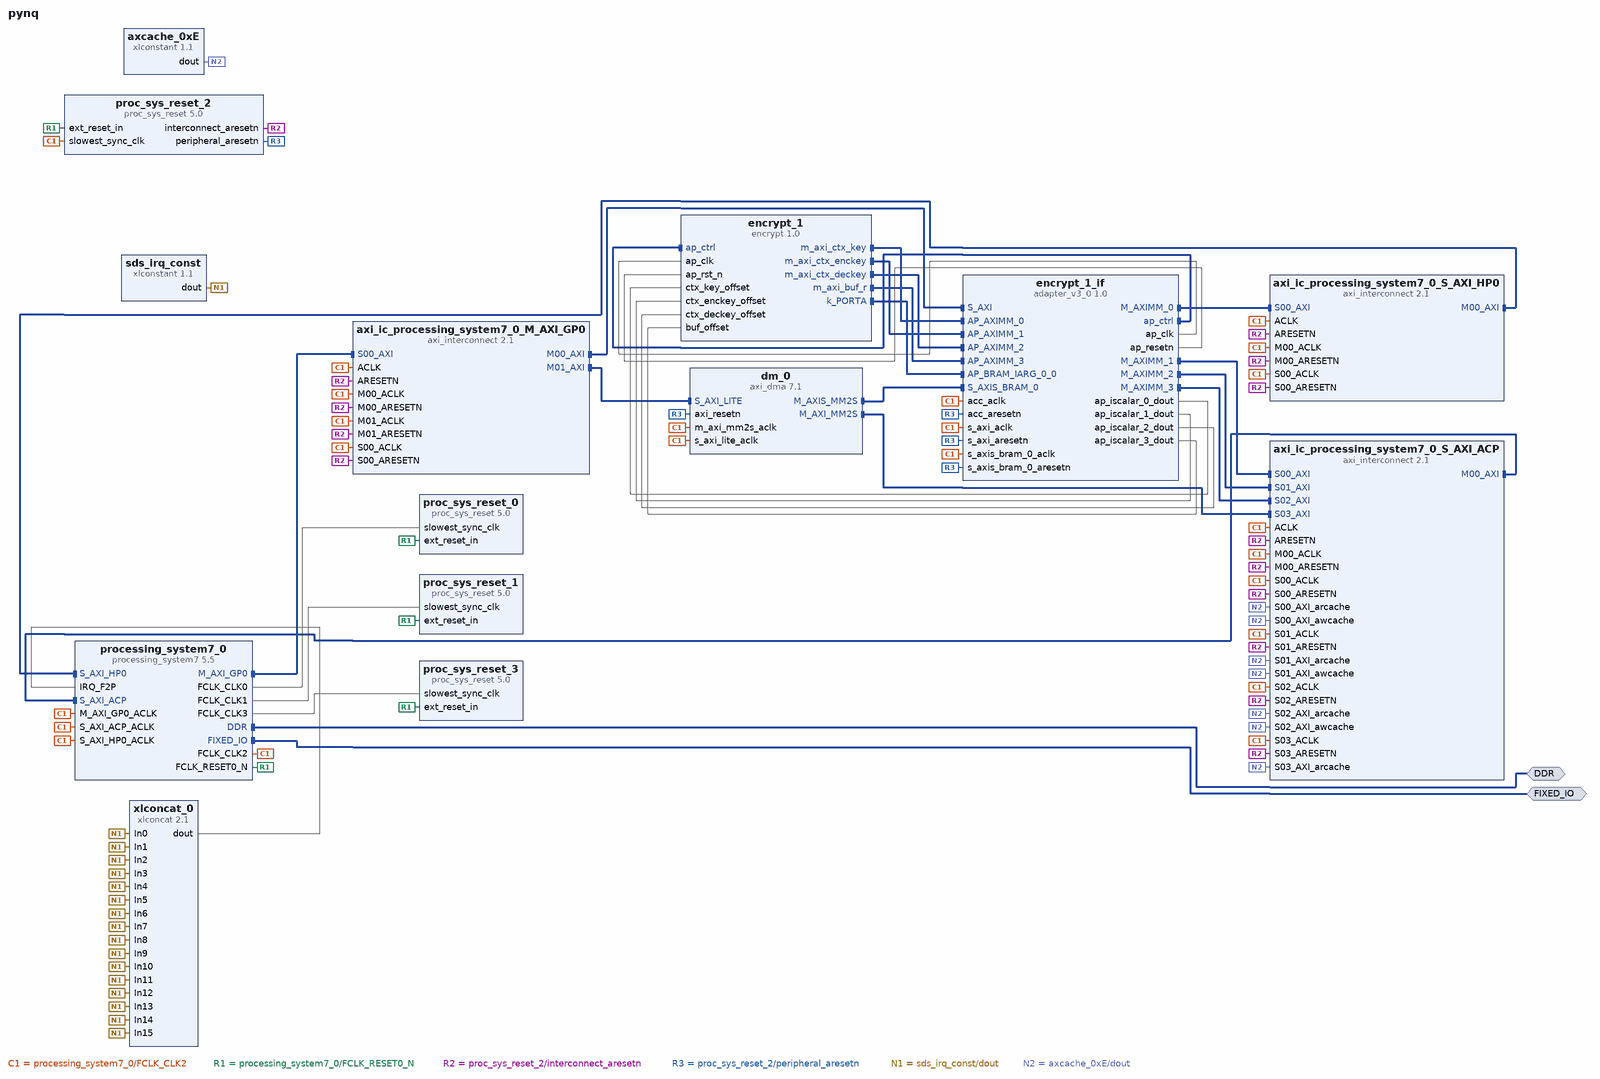
[diagram p0: block diagram of the top level]
# Vivado block design pynq, xc7z020clg400-1, Vivado 2017.1_sdx
create_bd_design pynq

create_bd_intf_port -mode Master -vlnv xilinx.com:interface:ddrx_rtl:1.0 DDR
create_bd_intf_port -mode Master -vlnv xilinx.com:display_processing_system7:fixedio_rtl:1.0 FIXED_IO

create_bd_cell -type ip -vlnv xilinx.com:ip:proc_sys_reset:5.0 proc_sys_reset_0
create_bd_cell -type ip -vlnv xilinx.com:ip:proc_sys_reset:5.0 proc_sys_reset_1
create_bd_cell -type ip -vlnv xilinx.com:ip:proc_sys_reset:5.0 proc_sys_reset_2
create_bd_cell -type ip -vlnv xilinx.com:ip:proc_sys_reset:5.0 proc_sys_reset_3
create_bd_cell -type ip -vlnv xilinx.com:ip:processing_system7:5.5 processing_system7_0
set_property -dict [list \
  CONFIG.PCW_FCLK_CLK1_BUF TRUE \
  CONFIG.PCW_FCLK_CLK2_BUF TRUE \
  CONFIG.PCW_FCLK_CLK3_BUF TRUE \
  CONFIG.PCW_UIPARAM_DDR_FREQ_MHZ 525 \
  CONFIG.PCW_CRYSTAL_PERIPHERAL_FREQMHZ 50 \
  CONFIG.PCW_APU_PERIPHERAL_FREQMHZ 650 \
  CONFIG.PCW_SDIO_PERIPHERAL_FREQMHZ 50 \
  CONFIG.PCW_UART_PERIPHERAL_FREQMHZ 100 \
  CONFIG.PCW_FPGA0_PERIPHERAL_FREQMHZ 166 \
  CONFIG.PCW_FPGA1_PERIPHERAL_FREQMHZ 142 \
  CONFIG.PCW_FPGA2_PERIPHERAL_FREQMHZ 100 \
  CONFIG.PCW_FPGA3_PERIPHERAL_FREQMHZ 200 \
  CONFIG.PCW_USE_S_AXI_ACP 1 \
  CONFIG.PCW_USE_S_AXI_HP0 1 \
  CONFIG.PCW_USE_FABRIC_INTERRUPT 1 \
  CONFIG.PCW_USE_DEFAULT_ACP_USER_VAL 1 \
  CONFIG.PCW_EN_CLK1_PORT 1 \
  CONFIG.PCW_EN_CLK2_PORT 1 \
  CONFIG.PCW_EN_CLK3_PORT 1 \
  CONFIG.PCW_IRQ_F2P_INTR 1 \
  CONFIG.PCW_PERIPHERAL_BOARD_PRESET None \
  CONFIG.PCW_PRESET_BANK1_VOLTAGE {LVCMOS 1.8V} \
  CONFIG.PCW_UIPARAM_DDR_BUS_WIDTH {16 Bit} \
  CONFIG.PCW_UIPARAM_DDR_PARTNO {MT41J256M16 RE-125} \
  CONFIG.PCW_QSPI_PERIPHERAL_ENABLE 1 \
  CONFIG.PCW_QSPI_QSPI_IO {MIO 1 .. 6} \
  CONFIG.PCW_QSPI_GRP_SINGLE_SS_ENABLE 1 \
  CONFIG.PCW_QSPI_GRP_SINGLE_SS_IO {MIO 1 .. 6} \
  CONFIG.PCW_QSPI_GRP_FBCLK_ENABLE 1 \
  CONFIG.PCW_QSPI_GRP_FBCLK_IO {MIO 8} \
  CONFIG.PCW_ENET0_PERIPHERAL_ENABLE 1 \
  CONFIG.PCW_ENET0_ENET0_IO {MIO 16 .. 27} \
  CONFIG.PCW_ENET0_GRP_MDIO_ENABLE 1 \
  CONFIG.PCW_ENET0_GRP_MDIO_IO {MIO 52 .. 53} \
  CONFIG.PCW_ENET_RESET_ENABLE 1 \
  CONFIG.PCW_ENET_RESET_SELECT {Share reset pin} \
  CONFIG.PCW_ENET0_RESET_ENABLE 1 \
  CONFIG.PCW_ENET0_RESET_IO {MIO 9} \
  CONFIG.PCW_SD0_PERIPHERAL_ENABLE 1 \
  CONFIG.PCW_SD0_SD0_IO {MIO 40 .. 45} \
  CONFIG.PCW_SD0_GRP_CD_ENABLE 1 \
  CONFIG.PCW_SD0_GRP_CD_IO {MIO 47} \
  CONFIG.PCW_SD0_GRP_WP_ENABLE 0 \
  CONFIG.PCW_UART0_PERIPHERAL_ENABLE 1 \
  CONFIG.PCW_UART0_UART0_IO {MIO 14 .. 15} \
  CONFIG.PCW_UART1_PERIPHERAL_ENABLE 0 \
  CONFIG.PCW_USB0_PERIPHERAL_ENABLE 1 \
  CONFIG.PCW_USB0_USB0_IO {MIO 28 .. 39} \
  CONFIG.PCW_USB_RESET_ENABLE 1 \
  CONFIG.PCW_USB_RESET_SELECT {Share reset pin} \
  CONFIG.PCW_USB0_RESET_ENABLE 1 \
  CONFIG.PCW_USB0_RESET_IO {MIO 46} \
  CONFIG.PCW_I2C_RESET_ENABLE 1 \
  CONFIG.PCW_GPIO_MIO_GPIO_ENABLE 1 \
  CONFIG.PCW_GPIO_MIO_GPIO_IO MIO \
  CONFIG.PCW_FPGA_FCLK1_ENABLE 1 \
  CONFIG.PCW_FPGA_FCLK2_ENABLE 1 \
  CONFIG.PCW_FPGA_FCLK3_ENABLE 1 \
] [get_bd_cells processing_system7_0]
# 502 more settings of processing_system7_0 are not shown: defaults, MIO pin electricals, DDR timing, and values the tool derives
create_bd_cell -type ip -vlnv xilinx.com:ip:xlconcat:2.1 xlconcat_0
set_property -dict {CONFIG.NUM_PORTS 16} [get_bd_cells xlconcat_0]
create_bd_cell -type ip -vlnv xilinx.com:ip:axi_dma:7.1 dm_0
set_property -dict [list \
  CONFIG.c_include_sg 0 \
  CONFIG.c_sg_length_width 23 \
  CONFIG.c_dlytmr_resolution 1250 \
  CONFIG.c_include_mm2s 1 \
  CONFIG.c_m_axi_mm2s_data_width 64 \
  CONFIG.c_m_axis_mm2s_tdata_width 64 \
  CONFIG.c_include_mm2s_dre 1 \
  CONFIG.c_include_mm2s_sf 1 \
  CONFIG.c_mm2s_burst_size 64 \
  CONFIG.c_include_s2mm 0 \
] [get_bd_cells dm_0]
create_bd_cell -type ip -vlnv xilinx.com:hls:encrypt:1.0 encrypt_1
create_bd_cell -type ip -vlnv xilinx.com:ip:adapter_v3_0:1.0 encrypt_1_if
set_property -dict [list \
  CONFIG.C_N_INPUT_SCALARS 4 \
  CONFIG.C_INPUT_SCALAR_0_WIDTH 32 \
  CONFIG.C_INPUT_SCALAR_1_WIDTH 32 \
  CONFIG.C_INPUT_SCALAR_2_WIDTH 32 \
  CONFIG.C_INPUT_SCALAR_3_WIDTH 32 \
  CONFIG.C_NUM_INPUT_BRAMs 1 \
  CONFIG.S_AXIS_BRAM_0_WIDTH 8 \
  CONFIG.S_AXIS_BRAM_0_DEPTH 32 \
  CONFIG.S_AXIS_BRAM_0_DMWIDTH 64 \
  CONFIG.S_AXIS_BRAM_0_MB_DEPTH 1 \
  CONFIG.C_NUM_AXIMMs 4 \
  CONFIG.M_AXIMM_ADDR_WIDTH 32 \
] [get_bd_cells encrypt_1_if]
create_bd_cell -type ip -vlnv xilinx.com:ip:axi_interconnect:2.1 axi_ic_processing_system7_0_M_AXI_GP0
set_property -dict [list \
  CONFIG.NUM_SI 1 \
  CONFIG.NUM_MI 2 \
  CONFIG.STRATEGY 2 \
  CONFIG.M00_HAS_REGSLICE 1 \
  CONFIG.M01_HAS_REGSLICE 1 \
  CONFIG.S00_HAS_REGSLICE 1 \
] [get_bd_cells axi_ic_processing_system7_0_M_AXI_GP0]
create_bd_cell -type ip -vlnv xilinx.com:ip:axi_interconnect:2.1 axi_ic_processing_system7_0_S_AXI_HP0
set_property -dict [list \
  CONFIG.NUM_SI 1 \
  CONFIG.NUM_MI 1 \
  CONFIG.STRATEGY 0 \
  CONFIG.M00_HAS_REGSLICE 1 \
  CONFIG.M00_HAS_DATA_FIFO 2 \
  CONFIG.S00_HAS_REGSLICE 1 \
  CONFIG.S00_HAS_DATA_FIFO 2 \
] [get_bd_cells axi_ic_processing_system7_0_S_AXI_HP0]
create_bd_cell -type ip -vlnv xilinx.com:ip:axi_interconnect:2.1 axi_ic_processing_system7_0_S_AXI_ACP
set_property -dict [list \
  CONFIG.NUM_SI 4 \
  CONFIG.NUM_MI 1 \
  CONFIG.STRATEGY 2 \
  CONFIG.M00_HAS_REGSLICE 1 \
  CONFIG.M00_HAS_DATA_FIFO 2 \
  CONFIG.S00_HAS_REGSLICE 1 \
  CONFIG.S01_HAS_REGSLICE 1 \
  CONFIG.S02_HAS_REGSLICE 1 \
  CONFIG.S03_HAS_REGSLICE 1 \
  CONFIG.S00_HAS_DATA_FIFO 2 \
  CONFIG.S01_HAS_DATA_FIFO 2 \
  CONFIG.S02_HAS_DATA_FIFO 2 \
  CONFIG.S03_HAS_DATA_FIFO 2 \
] [get_bd_cells axi_ic_processing_system7_0_S_AXI_ACP]
create_bd_cell -type ip -vlnv xilinx.com:ip:xlconstant:1.1 sds_irq_const
set_property -dict {CONFIG.CONST_WIDTH 1 CONFIG.CONST_VAL 0} [get_bd_cells sds_irq_const]
create_bd_cell -type ip -vlnv xilinx.com:ip:xlconstant:1.1 axcache_0xE
set_property -dict {CONFIG.CONST_WIDTH 4 CONFIG.CONST_VAL 14} [get_bd_cells axcache_0xE]

# ---- connections ----

connect_bd_intf_net [get_bd_intf_pins encrypt_1_if/ap_ctrl] [get_bd_intf_pins encrypt_1/ap_ctrl]
connect_bd_intf_net [get_bd_intf_pins encrypt_1/m_axi_ctx_key] [get_bd_intf_pins encrypt_1_if/AP_AXIMM_0]
connect_bd_intf_net [get_bd_intf_pins encrypt_1/m_axi_ctx_enckey] [get_bd_intf_pins encrypt_1_if/AP_AXIMM_1]
connect_bd_intf_net [get_bd_intf_pins encrypt_1/m_axi_ctx_deckey] [get_bd_intf_pins encrypt_1_if/AP_AXIMM_2]
connect_bd_intf_net [get_bd_intf_pins encrypt_1/m_axi_buf_r] [get_bd_intf_pins encrypt_1_if/AP_AXIMM_3]
connect_bd_intf_net [get_bd_intf_pins encrypt_1/k_PORTA] [get_bd_intf_pins encrypt_1_if/AP_BRAM_IARG_0_0]
connect_bd_intf_net [get_bd_intf_pins processing_system7_0/M_AXI_GP0] [get_bd_intf_pins axi_ic_processing_system7_0_M_AXI_GP0/S00_AXI]
connect_bd_intf_net [get_bd_intf_pins axi_ic_processing_system7_0_S_AXI_HP0/M00_AXI] [get_bd_intf_pins processing_system7_0/S_AXI_HP0]
connect_bd_intf_net [get_bd_intf_pins axi_ic_processing_system7_0_S_AXI_ACP/M00_AXI] [get_bd_intf_pins processing_system7_0/S_AXI_ACP]
connect_bd_intf_net [get_bd_intf_pins encrypt_1_if/M_AXIMM_0] [get_bd_intf_pins axi_ic_processing_system7_0_S_AXI_HP0/S00_AXI]
connect_bd_intf_net [get_bd_intf_pins encrypt_1_if/M_AXIMM_1] [get_bd_intf_pins axi_ic_processing_system7_0_S_AXI_ACP/S00_AXI]
connect_bd_intf_net [get_bd_intf_pins encrypt_1_if/M_AXIMM_2] [get_bd_intf_pins axi_ic_processing_system7_0_S_AXI_ACP/S01_AXI]
connect_bd_intf_net [get_bd_intf_pins encrypt_1_if/M_AXIMM_3] [get_bd_intf_pins axi_ic_processing_system7_0_S_AXI_ACP/S02_AXI]
connect_bd_intf_net [get_bd_intf_pins axi_ic_processing_system7_0_M_AXI_GP0/M00_AXI] [get_bd_intf_pins encrypt_1_if/S_AXI]
connect_bd_intf_net [get_bd_intf_pins axi_ic_processing_system7_0_M_AXI_GP0/M01_AXI] [get_bd_intf_pins dm_0/S_AXI_LITE]
connect_bd_intf_net [get_bd_intf_pins dm_0/M_AXI_MM2S] [get_bd_intf_pins axi_ic_processing_system7_0_S_AXI_ACP/S03_AXI]
connect_bd_intf_net [get_bd_intf_pins dm_0/M_AXIS_MM2S] [get_bd_intf_pins encrypt_1_if/S_AXIS_BRAM_0]
connect_bd_intf_net [get_bd_intf_ports DDR] [get_bd_intf_pins processing_system7_0/DDR]
connect_bd_intf_net [get_bd_intf_ports FIXED_IO] [get_bd_intf_pins processing_system7_0/FIXED_IO]
connect_bd_net [get_bd_pins processing_system7_0/FCLK_CLK0] [get_bd_pins proc_sys_reset_0/slowest_sync_clk]
connect_bd_net [get_bd_pins processing_system7_0/FCLK_CLK1] [get_bd_pins proc_sys_reset_1/slowest_sync_clk]
connect_bd_net [get_bd_pins processing_system7_0/FCLK_CLK2] \
  [get_bd_pins proc_sys_reset_2/slowest_sync_clk] [get_bd_pins dm_0/s_axi_lite_aclk] [get_bd_pins dm_0/m_axi_mm2s_aclk] \
  [get_bd_pins processing_system7_0/M_AXI_GP0_ACLK] [get_bd_pins encrypt_1_if/s_axi_aclk] [get_bd_pins encrypt_1_if/acc_aclk] \
  [get_bd_pins encrypt_1_if/s_axis_bram_0_aclk] [get_bd_pins axi_ic_processing_system7_0_M_AXI_GP0/S00_ACLK] \
  [get_bd_pins axi_ic_processing_system7_0_M_AXI_GP0/M00_ACLK] [get_bd_pins axi_ic_processing_system7_0_M_AXI_GP0/M01_ACLK] \
  [get_bd_pins axi_ic_processing_system7_0_M_AXI_GP0/ACLK] [get_bd_pins axi_ic_processing_system7_0_S_AXI_HP0/M00_ACLK] \
  [get_bd_pins axi_ic_processing_system7_0_S_AXI_HP0/S00_ACLK] [get_bd_pins axi_ic_processing_system7_0_S_AXI_ACP/M00_ACLK] \
  [get_bd_pins axi_ic_processing_system7_0_S_AXI_ACP/S00_ACLK] [get_bd_pins axi_ic_processing_system7_0_S_AXI_ACP/S01_ACLK] \
  [get_bd_pins axi_ic_processing_system7_0_S_AXI_ACP/S02_ACLK] [get_bd_pins axi_ic_processing_system7_0_S_AXI_ACP/S03_ACLK] \
  [get_bd_pins axi_ic_processing_system7_0_S_AXI_HP0/ACLK] [get_bd_pins processing_system7_0/S_AXI_HP0_ACLK] \
  [get_bd_pins axi_ic_processing_system7_0_S_AXI_ACP/ACLK] [get_bd_pins processing_system7_0/S_AXI_ACP_ACLK]
connect_bd_net [get_bd_pins processing_system7_0/FCLK_CLK3] [get_bd_pins proc_sys_reset_3/slowest_sync_clk]
connect_bd_net [get_bd_pins processing_system7_0/FCLK_RESET0_N] \
  [get_bd_pins proc_sys_reset_0/ext_reset_in] [get_bd_pins proc_sys_reset_1/ext_reset_in] \
  [get_bd_pins proc_sys_reset_2/ext_reset_in] [get_bd_pins proc_sys_reset_3/ext_reset_in]
connect_bd_net [get_bd_pins xlconcat_0/dout] [get_bd_pins processing_system7_0/IRQ_F2P]
connect_bd_net [get_bd_pins encrypt_1_if/ap_clk] [get_bd_pins encrypt_1/ap_clk]
connect_bd_net [get_bd_pins encrypt_1_if/ap_resetn] [get_bd_pins encrypt_1/ap_rst_n]
connect_bd_net [get_bd_pins encrypt_1_if/ap_iscalar_0_dout] [get_bd_pins encrypt_1/ctx_key_offset]
connect_bd_net [get_bd_pins encrypt_1_if/ap_iscalar_1_dout] [get_bd_pins encrypt_1/ctx_enckey_offset]
connect_bd_net [get_bd_pins encrypt_1_if/ap_iscalar_2_dout] [get_bd_pins encrypt_1/ctx_deckey_offset]
connect_bd_net [get_bd_pins encrypt_1_if/ap_iscalar_3_dout] [get_bd_pins encrypt_1/buf_offset]
connect_bd_net [get_bd_pins proc_sys_reset_2/interconnect_aresetn] \
  [get_bd_pins axi_ic_processing_system7_0_M_AXI_GP0/S00_ARESETN] \
  [get_bd_pins axi_ic_processing_system7_0_M_AXI_GP0/M00_ARESETN] \
  [get_bd_pins axi_ic_processing_system7_0_M_AXI_GP0/M01_ARESETN] [get_bd_pins axi_ic_processing_system7_0_M_AXI_GP0/ARESETN] \
  [get_bd_pins axi_ic_processing_system7_0_S_AXI_HP0/M00_ARESETN] \
  [get_bd_pins axi_ic_processing_system7_0_S_AXI_HP0/S00_ARESETN] \
  [get_bd_pins axi_ic_processing_system7_0_S_AXI_ACP/M00_ARESETN] \
  [get_bd_pins axi_ic_processing_system7_0_S_AXI_ACP/S00_ARESETN] \
  [get_bd_pins axi_ic_processing_system7_0_S_AXI_ACP/S01_ARESETN] \
  [get_bd_pins axi_ic_processing_system7_0_S_AXI_ACP/S02_ARESETN] \
  [get_bd_pins axi_ic_processing_system7_0_S_AXI_ACP/S03_ARESETN] [get_bd_pins axi_ic_processing_system7_0_S_AXI_HP0/ARESETN] \
  [get_bd_pins axi_ic_processing_system7_0_S_AXI_ACP/ARESETN]
connect_bd_net [get_bd_pins proc_sys_reset_2/peripheral_aresetn] \
  [get_bd_pins dm_0/axi_resetn] [get_bd_pins encrypt_1_if/s_axi_aresetn] [get_bd_pins encrypt_1_if/acc_aresetn] \
  [get_bd_pins encrypt_1_if/s_axis_bram_0_aresetn]
connect_bd_net [get_bd_pins sds_irq_const/dout] \
  [get_bd_pins xlconcat_0/In0] [get_bd_pins xlconcat_0/In1] [get_bd_pins xlconcat_0/In2] [get_bd_pins xlconcat_0/In3] \
  [get_bd_pins xlconcat_0/In4] [get_bd_pins xlconcat_0/In5] [get_bd_pins xlconcat_0/In6] [get_bd_pins xlconcat_0/In7] \
  [get_bd_pins xlconcat_0/In8] [get_bd_pins xlconcat_0/In9] [get_bd_pins xlconcat_0/In10] [get_bd_pins xlconcat_0/In11] \
  [get_bd_pins xlconcat_0/In12] [get_bd_pins xlconcat_0/In13] [get_bd_pins xlconcat_0/In14] [get_bd_pins xlconcat_0/In15]
connect_bd_net [get_bd_pins axcache_0xE/dout] \
  [get_bd_pins axi_ic_processing_system7_0_S_AXI_ACP/S03_AXI_arcache] \
  [get_bd_pins axi_ic_processing_system7_0_S_AXI_ACP/S00_AXI_arcache] \
  [get_bd_pins axi_ic_processing_system7_0_S_AXI_ACP/S00_AXI_awcache] \
  [get_bd_pins axi_ic_processing_system7_0_S_AXI_ACP/S01_AXI_arcache] \
  [get_bd_pins axi_ic_processing_system7_0_S_AXI_ACP/S01_AXI_awcache] \
  [get_bd_pins axi_ic_processing_system7_0_S_AXI_ACP/S02_AXI_arcache] \
  [get_bd_pins axi_ic_processing_system7_0_S_AXI_ACP/S02_AXI_awcache]

# ---- address map ----
assign_bd_address -offset 0x00000000 -range 512M -target_address_space [get_bd_addr_spaces dm_0/Data_MM2S] [get_bd_addr_segs processing_system7_0/S_AXI_ACP/ACP_DDR_LOWOCM]
assign_bd_address -offset 0x40000000 -range 1G -target_address_space [get_bd_addr_spaces dm_0/Data_MM2S] [get_bd_addr_segs processing_system7_0/S_AXI_ACP/ACP_M_AXI_GP0]
assign_bd_address -offset 0xE0000000 -range 4M -target_address_space [get_bd_addr_spaces dm_0/Data_MM2S] [get_bd_addr_segs processing_system7_0/S_AXI_ACP/ACP_IOP]
assign_bd_address -offset 0xFC000000 -range 16M -target_address_space [get_bd_addr_spaces dm_0/Data_MM2S] [get_bd_addr_segs processing_system7_0/S_AXI_ACP/ACP_QSPI_LINEAR]
assign_bd_address -offset 0x00000000 -range 4G -target_address_space [get_bd_addr_spaces encrypt_1/Data_m_axi_buf_r] [get_bd_addr_segs encrypt_1_if/AP_AXIMM_3/reg0]
assign_bd_address -offset 0x00000000 -range 4G -target_address_space [get_bd_addr_spaces encrypt_1/Data_m_axi_ctx_deckey] [get_bd_addr_segs encrypt_1_if/AP_AXIMM_2/reg0]
assign_bd_address -offset 0x00000000 -range 4G -target_address_space [get_bd_addr_spaces encrypt_1/Data_m_axi_ctx_enckey] [get_bd_addr_segs encrypt_1_if/AP_AXIMM_1/reg0]
assign_bd_address -offset 0x00000000 -range 4G -target_address_space [get_bd_addr_spaces encrypt_1/Data_m_axi_ctx_key] [get_bd_addr_segs encrypt_1_if/AP_AXIMM_0/reg0]
assign_bd_address -offset 0x00000000 -range 512M -target_address_space [get_bd_addr_spaces encrypt_1_if/M_AXIMM_0] [get_bd_addr_segs processing_system7_0/S_AXI_HP0/HP0_DDR_LOWOCM]
assign_bd_address -offset 0x00000000 -range 512M -target_address_space [get_bd_addr_spaces encrypt_1_if/M_AXIMM_1] [get_bd_addr_segs processing_system7_0/S_AXI_ACP/ACP_DDR_LOWOCM]
assign_bd_address -offset 0x40000000 -range 1G -target_address_space [get_bd_addr_spaces encrypt_1_if/M_AXIMM_1] [get_bd_addr_segs processing_system7_0/S_AXI_ACP/ACP_M_AXI_GP0]
assign_bd_address -offset 0xE0000000 -range 4M -target_address_space [get_bd_addr_spaces encrypt_1_if/M_AXIMM_1] [get_bd_addr_segs processing_system7_0/S_AXI_ACP/ACP_IOP]
assign_bd_address -offset 0xFC000000 -range 16M -target_address_space [get_bd_addr_spaces encrypt_1_if/M_AXIMM_1] [get_bd_addr_segs processing_system7_0/S_AXI_ACP/ACP_QSPI_LINEAR]
assign_bd_address -offset 0x00000000 -range 512M -target_address_space [get_bd_addr_spaces encrypt_1_if/M_AXIMM_2] [get_bd_addr_segs processing_system7_0/S_AXI_ACP/ACP_DDR_LOWOCM]
assign_bd_address -offset 0x40000000 -range 1G -target_address_space [get_bd_addr_spaces encrypt_1_if/M_AXIMM_2] [get_bd_addr_segs processing_system7_0/S_AXI_ACP/ACP_M_AXI_GP0]
assign_bd_address -offset 0xE0000000 -range 4M -target_address_space [get_bd_addr_spaces encrypt_1_if/M_AXIMM_2] [get_bd_addr_segs processing_system7_0/S_AXI_ACP/ACP_IOP]
assign_bd_address -offset 0xFC000000 -range 16M -target_address_space [get_bd_addr_spaces encrypt_1_if/M_AXIMM_2] [get_bd_addr_segs processing_system7_0/S_AXI_ACP/ACP_QSPI_LINEAR]
assign_bd_address -offset 0x00000000 -range 512M -target_address_space [get_bd_addr_spaces encrypt_1_if/M_AXIMM_3] [get_bd_addr_segs processing_system7_0/S_AXI_ACP/ACP_DDR_LOWOCM]
assign_bd_address -offset 0x40000000 -range 1G -target_address_space [get_bd_addr_spaces encrypt_1_if/M_AXIMM_3] [get_bd_addr_segs processing_system7_0/S_AXI_ACP/ACP_M_AXI_GP0]
assign_bd_address -offset 0xE0000000 -range 4M -target_address_space [get_bd_addr_spaces encrypt_1_if/M_AXIMM_3] [get_bd_addr_segs processing_system7_0/S_AXI_ACP/ACP_IOP]
assign_bd_address -offset 0xFC000000 -range 16M -target_address_space [get_bd_addr_spaces encrypt_1_if/M_AXIMM_3] [get_bd_addr_segs processing_system7_0/S_AXI_ACP/ACP_QSPI_LINEAR]
assign_bd_address -offset 0x40400000 -range 64K -target_address_space [get_bd_addr_spaces processing_system7_0/Data] [get_bd_addr_segs dm_0/S_AXI_LITE/Reg]
assign_bd_address -offset 0x43C00000 -range 64K -target_address_space [get_bd_addr_spaces processing_system7_0/Data] [get_bd_addr_segs encrypt_1_if/S_AXI/reg0]

validate_bd_design
save_bd_design
